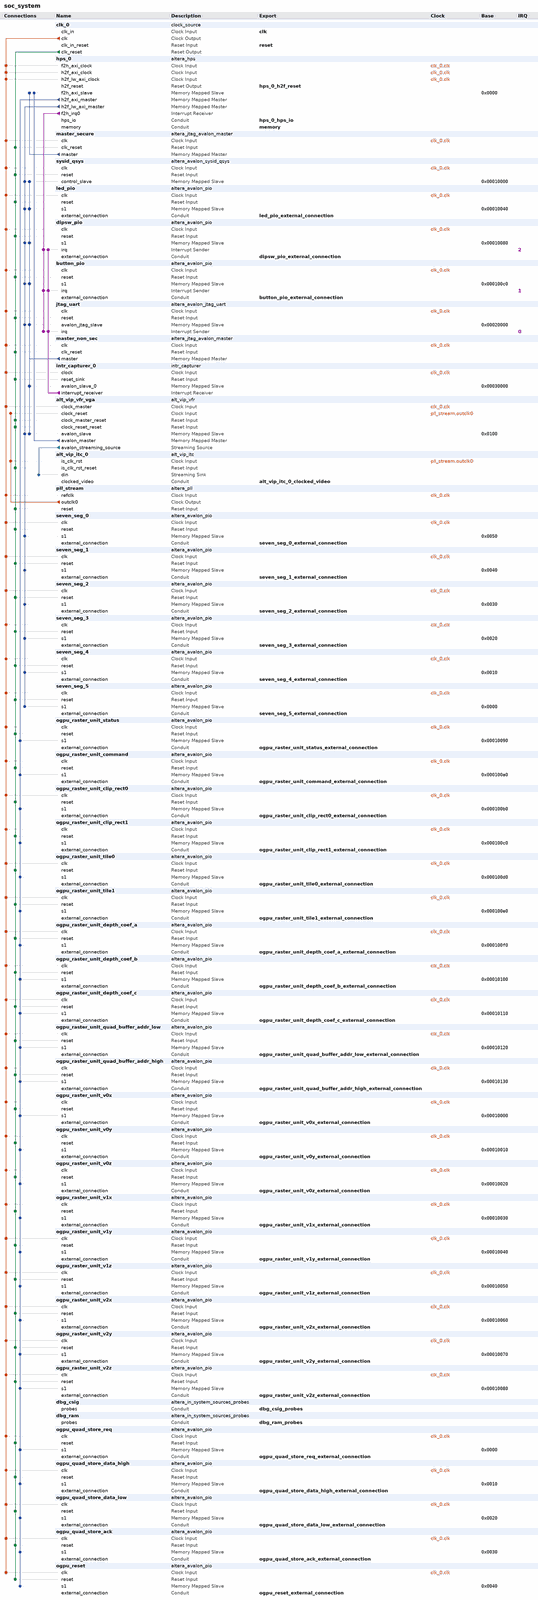
[diagram p0: system contents, whole]
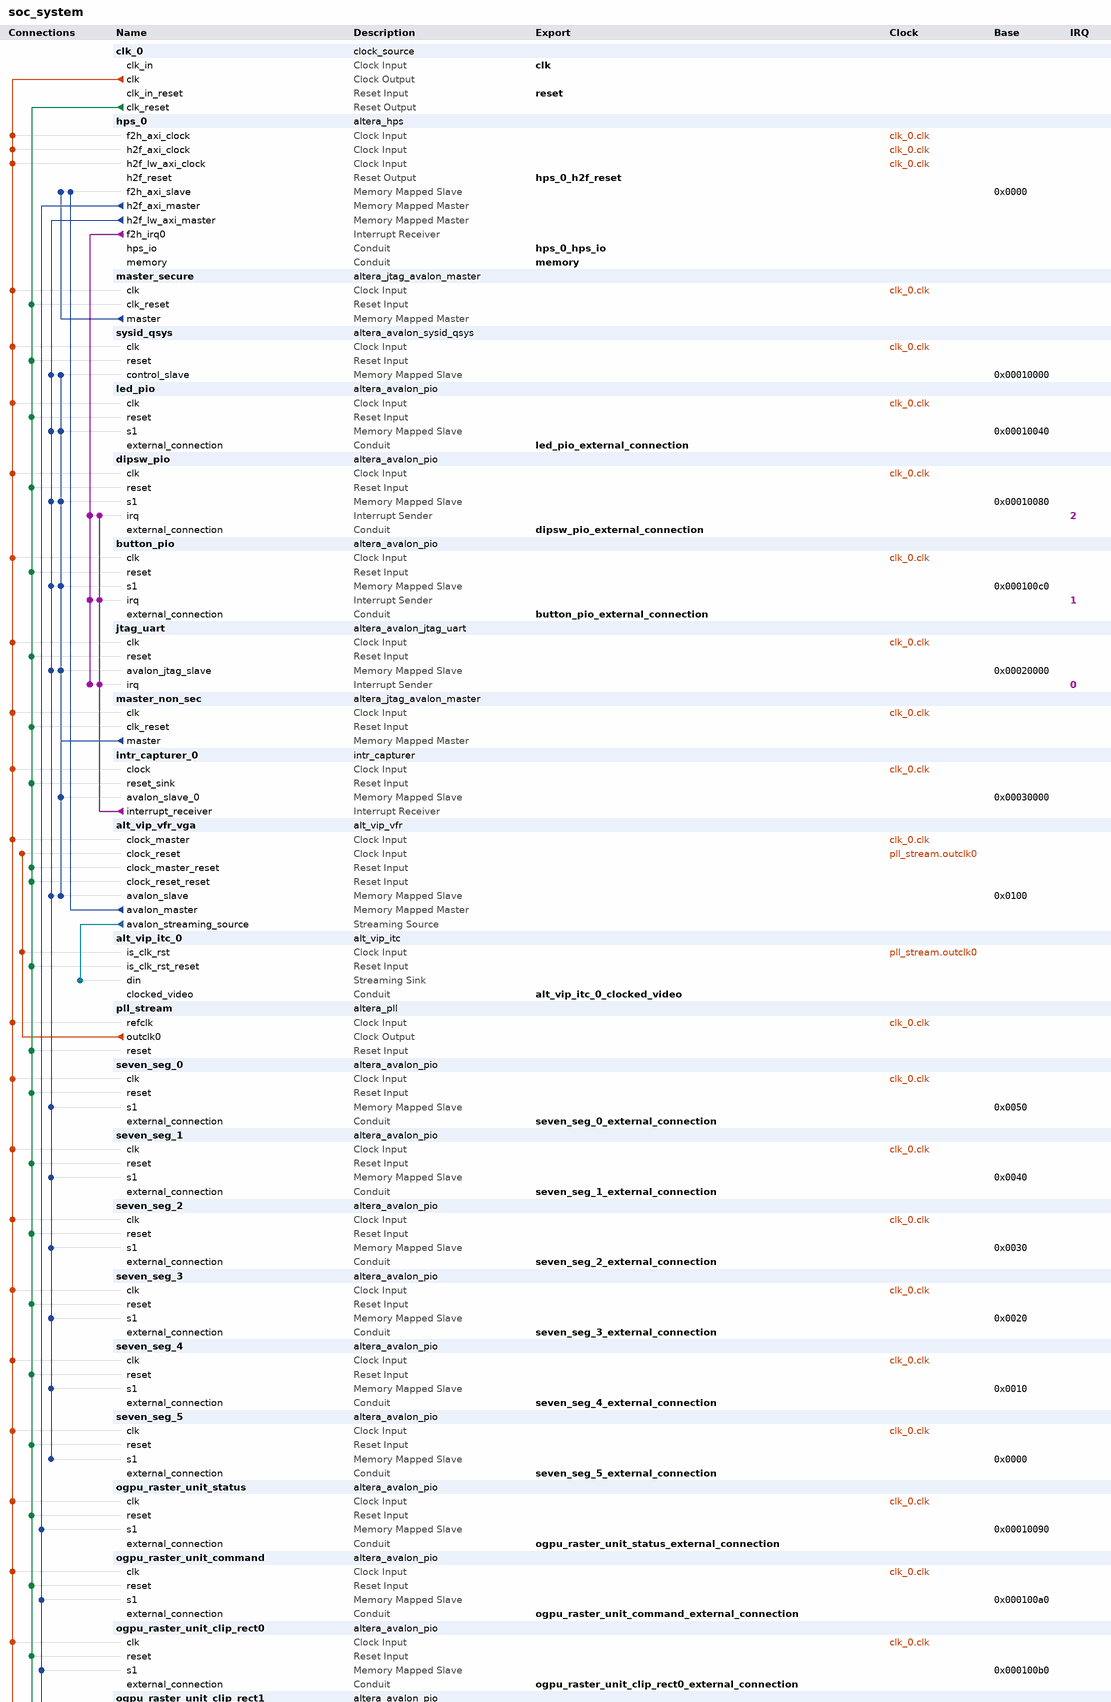
[diagram p1: system contents, upper part]
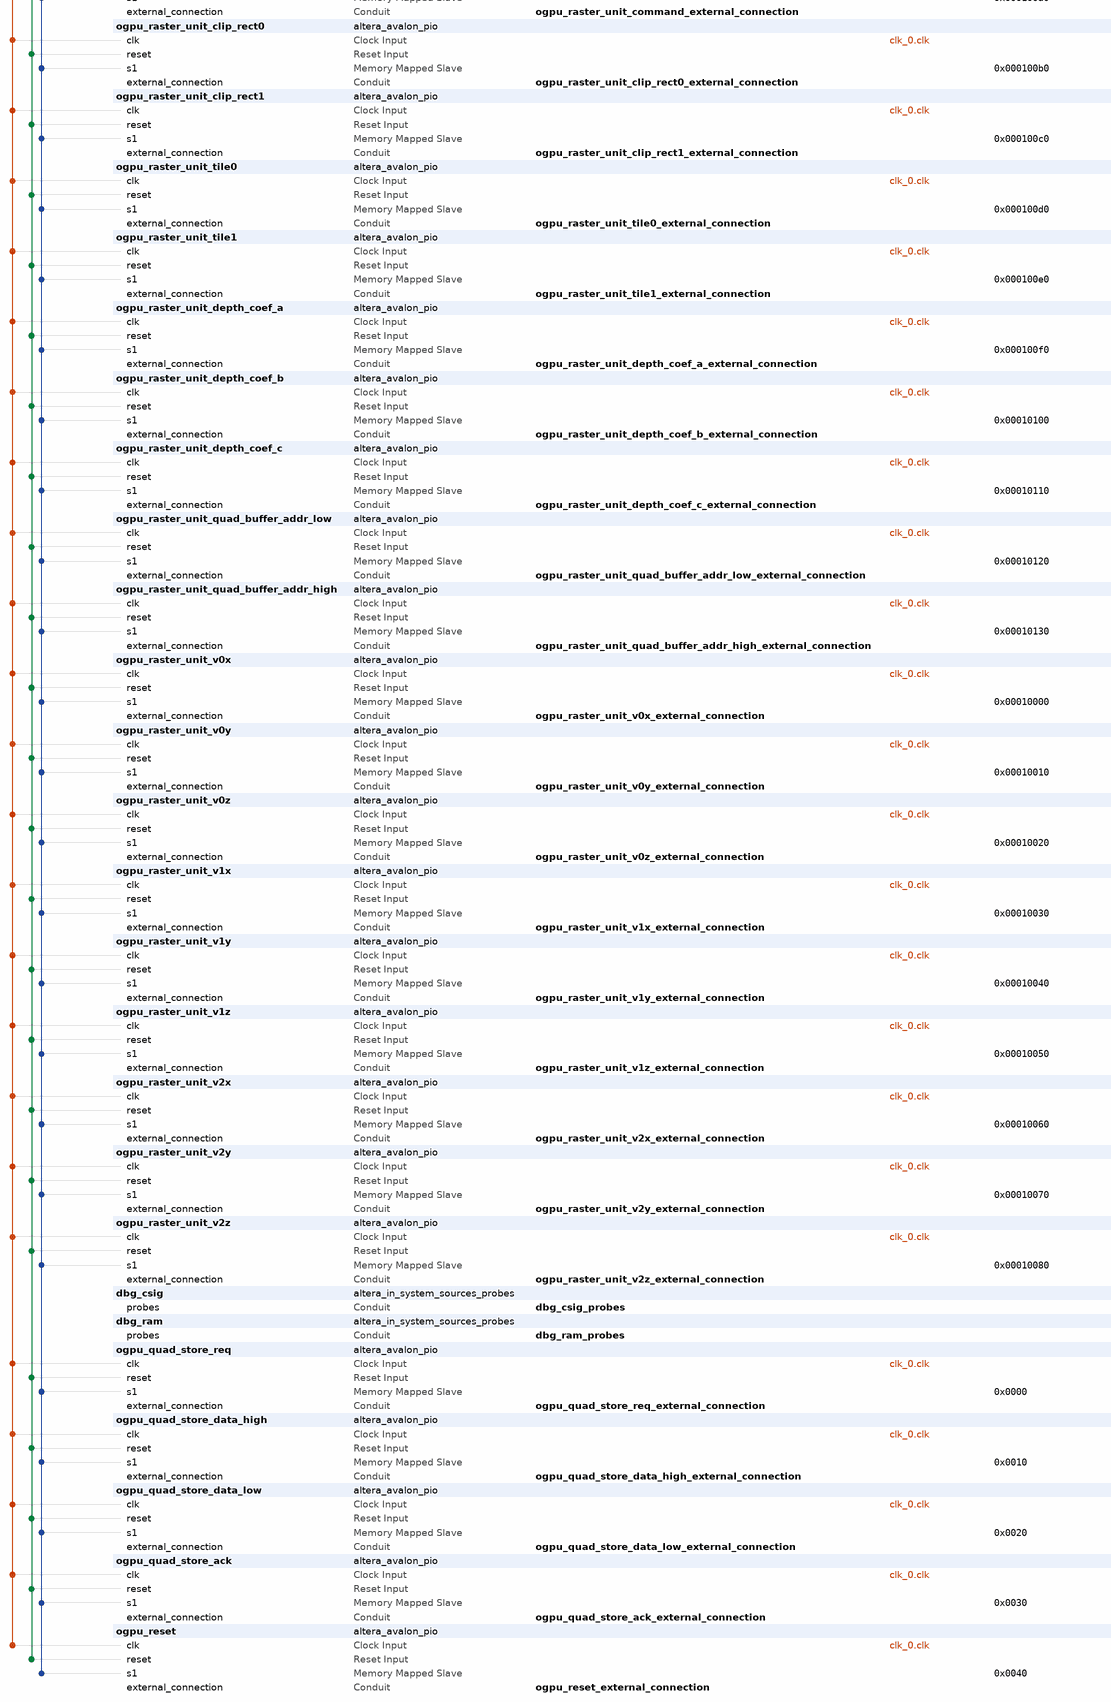
[diagram p2: system contents, lower part]
# Platform Designer (Qsys) system soc_system, Cyclone V 5CSEMA5F31C6
# Parameters at their usual value, and those the tool derives, are not listed.
package require -exact qsys 16.0
create_system soc_system
set_project_property DEVICE_FAMILY {Cyclone V}
set_project_property DEVICE 5CSEMA5F31C6

add_instance clk_0 clock_source 16.0
set_instance_parameter_value clk_0 clockFrequency 50000000

add_instance hps_0 altera_hps 16.0
set_instance_parameter_value hps_0 BOOTFROMFPGA_Enable true
set_instance_parameter_value hps_0 EMAC1_Mode RGMII
set_instance_parameter_value hps_0 EMAC1_PinMuxing {HPS I/O Set 0}
set_instance_parameter_value hps_0 F2SCLK_COLDRST_Enable false
set_instance_parameter_value hps_0 F2SCLK_DBGRST_Enable false
set_instance_parameter_value hps_0 F2SCLK_WARMRST_Enable false
set_instance_parameter_value hps_0 F2SINTERRUPT_Enable true
set_instance_parameter_value hps_0 F2S_Width 3
set_instance_parameter_value hps_0 FPGA_PERIPHERAL_OUTPUT_CLOCK_FREQ_EMAC0_GTX_CLK 100
set_instance_parameter_value hps_0 FPGA_PERIPHERAL_OUTPUT_CLOCK_FREQ_EMAC0_MD_CLK 100.0
set_instance_parameter_value hps_0 FPGA_PERIPHERAL_OUTPUT_CLOCK_FREQ_EMAC1_GTX_CLK 100
set_instance_parameter_value hps_0 FPGA_PERIPHERAL_OUTPUT_CLOCK_FREQ_EMAC1_MD_CLK 100.0
set_instance_parameter_value hps_0 HPS_PROTOCOL DDR3
set_instance_parameter_value hps_0 I2C0_Mode I2C
set_instance_parameter_value hps_0 I2C0_PinMuxing {HPS I/O Set 0}
set_instance_parameter_value hps_0 I2C1_Mode I2C
set_instance_parameter_value hps_0 I2C1_PinMuxing {HPS I/O Set 0}
set_instance_parameter_value hps_0 LWH2F_Enable true
set_instance_parameter_value hps_0 MEM_BANKADDR_WIDTH 3
set_instance_parameter_value hps_0 MEM_CLK_FREQ 400.0
set_instance_parameter_value hps_0 MEM_COL_ADDR_WIDTH 10
set_instance_parameter_value hps_0 MEM_DQ_WIDTH 32
set_instance_parameter_value hps_0 MEM_DRV_STR RZQ/7
set_instance_parameter_value hps_0 MEM_ROW_ADDR_WIDTH 15
set_instance_parameter_value hps_0 MEM_RTT_NOM RZQ/4
set_instance_parameter_value hps_0 MEM_RTT_WR RZQ/4
set_instance_parameter_value hps_0 MEM_TCL 11
set_instance_parameter_value hps_0 MEM_TFAW_NS 30.0
set_instance_parameter_value hps_0 MEM_TRAS_NS 35.0
set_instance_parameter_value hps_0 MEM_TRCD_NS 13.75
set_instance_parameter_value hps_0 MEM_TRFC_NS 260.0
set_instance_parameter_value hps_0 MEM_TRP_NS 13.75
set_instance_parameter_value hps_0 MEM_VENDOR JEDEC
set_instance_parameter_value hps_0 MEM_WTCL 8
set_instance_parameter_value hps_0 QSPI_Mode {1 SS}
set_instance_parameter_value hps_0 QSPI_PinMuxing {HPS I/O Set 0}
set_instance_parameter_value hps_0 REF_CLK_FREQ 25.0
set_instance_parameter_value hps_0 S2FCLK_USER2CLK 1
set_instance_parameter_value hps_0 S2F_Width 2
set_instance_parameter_value hps_0 SDIO_Mode {4-bit Data}
set_instance_parameter_value hps_0 SDIO_PinMuxing {HPS I/O Set 0}
set_instance_parameter_value hps_0 SPIM1_Mode {Single Slave Select}
set_instance_parameter_value hps_0 SPIM1_PinMuxing {HPS I/O Set 0}
set_instance_parameter_value hps_0 STM_Enable false
set_instance_parameter_value hps_0 TIMING_BOARD_AC_SKEW 0.03
set_instance_parameter_value hps_0 TIMING_BOARD_AC_TO_CK_SKEW 0.0
set_instance_parameter_value hps_0 TIMING_BOARD_DQ_TO_DQS_SKEW 0.0
set_instance_parameter_value hps_0 TIMING_BOARD_MAX_CK_DELAY 0.03
set_instance_parameter_value hps_0 TIMING_BOARD_MAX_DQS_DELAY 0.02
set_instance_parameter_value hps_0 TIMING_BOARD_SKEW_BETWEEN_DQS 0.08
set_instance_parameter_value hps_0 TIMING_BOARD_SKEW_CKDQS_DIMM_MAX 0.16
set_instance_parameter_value hps_0 TIMING_BOARD_SKEW_CKDQS_DIMM_MIN 0.09
set_instance_parameter_value hps_0 TIMING_BOARD_SKEW_WITHIN_DQS 0.01
set_instance_parameter_value hps_0 TIMING_TDH 65
set_instance_parameter_value hps_0 TIMING_TDQSCK 255
set_instance_parameter_value hps_0 TIMING_TDQSQ 125
set_instance_parameter_value hps_0 TIMING_TDS 30
set_instance_parameter_value hps_0 TIMING_TIH 140
set_instance_parameter_value hps_0 TIMING_TIS 180
set_instance_parameter_value hps_0 TIMING_TQSH 0.4
set_instance_parameter_value hps_0 UART0_Mode {No Flow Control}
set_instance_parameter_value hps_0 UART0_PinMuxing {HPS I/O Set 0}
set_instance_parameter_value hps_0 USB1_Mode SDR
set_instance_parameter_value hps_0 USB1_PinMuxing {HPS I/O Set 0}
set_instance_parameter_value hps_0 desired_cfg_clk_mhz 100.0
set_instance_parameter_value hps_0 desired_qspi_clk_mhz 400.0

add_instance master_secure altera_jtag_avalon_master 16.0

add_instance sysid_qsys altera_avalon_sysid_qsys 16.0
set_instance_parameter_value sysid_qsys id -1395322110

add_instance led_pio altera_avalon_pio 16.0
set_instance_parameter_value led_pio direction Output
set_instance_parameter_value led_pio width 10

add_instance dipsw_pio altera_avalon_pio 16.0
set_instance_parameter_value dipsw_pio bitClearingEdgeCapReg true
set_instance_parameter_value dipsw_pio captureEdge true
set_instance_parameter_value dipsw_pio direction Input
set_instance_parameter_value dipsw_pio edgeType ANY
set_instance_parameter_value dipsw_pio generateIRQ true
set_instance_parameter_value dipsw_pio irqType EDGE
set_instance_parameter_value dipsw_pio width 10

add_instance button_pio altera_avalon_pio 16.0
set_instance_parameter_value button_pio bitClearingEdgeCapReg true
set_instance_parameter_value button_pio captureEdge true
set_instance_parameter_value button_pio direction Input
set_instance_parameter_value button_pio edgeType FALLING
set_instance_parameter_value button_pio generateIRQ true
set_instance_parameter_value button_pio irqType EDGE
set_instance_parameter_value button_pio width 2

add_instance jtag_uart altera_avalon_jtag_uart 16.0
set_instance_parameter_value jtag_uart allowMultipleConnections true
set_instance_parameter_value jtag_uart simInteractiveOptions INTERACTIVE_ASCII_OUTPUT

add_instance master_non_sec altera_jtag_avalon_master 16.0

add_instance intr_capturer_0 intr_capturer 100.99.98.97

add_instance alt_vip_vfr_vga alt_vip_vfr 14.0
set_instance_parameter_value alt_vip_vfr_vga MAX_IMAGE_WIDTH 1024

add_instance alt_vip_itc_0 alt_vip_itc 14.0
set_instance_parameter_value alt_vip_itc_0 FIFO_DEPTH 1920
set_instance_parameter_value alt_vip_itc_0 H_ACTIVE_PIXELS 1024
set_instance_parameter_value alt_vip_itc_0 H_BACK_PORCH 160
set_instance_parameter_value alt_vip_itc_0 H_FRONT_PORCH 24
set_instance_parameter_value alt_vip_itc_0 H_SYNC_LENGTH 136
set_instance_parameter_value alt_vip_itc_0 NUMBER_OF_COLOUR_PLANES 4
set_instance_parameter_value alt_vip_itc_0 THRESHOLD 1919
set_instance_parameter_value alt_vip_itc_0 V_ACTIVE_LINES 768
set_instance_parameter_value alt_vip_itc_0 V_BACK_PORCH 29
set_instance_parameter_value alt_vip_itc_0 V_FRONT_PORCH 3
set_instance_parameter_value alt_vip_itc_0 V_SYNC_LENGTH 6

add_instance pll_stream altera_pll 16.0
set_instance_parameter_value pll_stream gui_device_speed_grade 2
set_instance_parameter_value pll_stream gui_number_of_clocks 1
set_instance_parameter_value pll_stream gui_operation_mode normal
set_instance_parameter_value pll_stream gui_output_clock_frequency0 130.0
set_instance_parameter_value pll_stream gui_pll_mode {Fractional-N PLL}
set_instance_parameter_value pll_stream gui_reference_clock_frequency 50.0
set_instance_parameter_value pll_stream gui_use_locked true

add_instance seven_seg_0 altera_avalon_pio 16.0
set_instance_parameter_value seven_seg_0 direction Output
set_instance_parameter_value seven_seg_0 width 7

add_instance seven_seg_1 altera_avalon_pio 16.0
set_instance_parameter_value seven_seg_1 direction Output
set_instance_parameter_value seven_seg_1 width 7

add_instance seven_seg_2 altera_avalon_pio 16.0
set_instance_parameter_value seven_seg_2 direction Output
set_instance_parameter_value seven_seg_2 width 7

add_instance seven_seg_3 altera_avalon_pio 16.0
set_instance_parameter_value seven_seg_3 direction Output
set_instance_parameter_value seven_seg_3 width 7

add_instance seven_seg_4 altera_avalon_pio 16.0
set_instance_parameter_value seven_seg_4 direction Output
set_instance_parameter_value seven_seg_4 width 7

add_instance seven_seg_5 altera_avalon_pio 16.0
set_instance_parameter_value seven_seg_5 direction Output
set_instance_parameter_value seven_seg_5 width 7

add_instance ogpu_raster_unit_status altera_avalon_pio 16.0
set_instance_parameter_value ogpu_raster_unit_status direction Input
set_instance_parameter_value ogpu_raster_unit_status width 32

add_instance ogpu_raster_unit_command altera_avalon_pio 16.0
set_instance_parameter_value ogpu_raster_unit_command direction Output
set_instance_parameter_value ogpu_raster_unit_command width 8

add_instance ogpu_raster_unit_clip_rect0 altera_avalon_pio 16.0
set_instance_parameter_value ogpu_raster_unit_clip_rect0 direction Output
set_instance_parameter_value ogpu_raster_unit_clip_rect0 width 32

add_instance ogpu_raster_unit_clip_rect1 altera_avalon_pio 16.0
set_instance_parameter_value ogpu_raster_unit_clip_rect1 direction Output
set_instance_parameter_value ogpu_raster_unit_clip_rect1 width 32

add_instance ogpu_raster_unit_tile0 altera_avalon_pio 16.0
set_instance_parameter_value ogpu_raster_unit_tile0 direction Output
set_instance_parameter_value ogpu_raster_unit_tile0 width 32

add_instance ogpu_raster_unit_tile1 altera_avalon_pio 16.0
set_instance_parameter_value ogpu_raster_unit_tile1 direction Output
set_instance_parameter_value ogpu_raster_unit_tile1 width 32

add_instance ogpu_raster_unit_depth_coef_a altera_avalon_pio 16.0
set_instance_parameter_value ogpu_raster_unit_depth_coef_a direction Output
set_instance_parameter_value ogpu_raster_unit_depth_coef_a width 32

add_instance ogpu_raster_unit_depth_coef_b altera_avalon_pio 16.0
set_instance_parameter_value ogpu_raster_unit_depth_coef_b direction Output
set_instance_parameter_value ogpu_raster_unit_depth_coef_b width 32

add_instance ogpu_raster_unit_depth_coef_c altera_avalon_pio 16.0
set_instance_parameter_value ogpu_raster_unit_depth_coef_c direction Output
set_instance_parameter_value ogpu_raster_unit_depth_coef_c width 32

add_instance ogpu_raster_unit_quad_buffer_addr_low altera_avalon_pio 16.0
set_instance_parameter_value ogpu_raster_unit_quad_buffer_addr_low direction Output
set_instance_parameter_value ogpu_raster_unit_quad_buffer_addr_low width 32

add_instance ogpu_raster_unit_quad_buffer_addr_high altera_avalon_pio 16.0
set_instance_parameter_value ogpu_raster_unit_quad_buffer_addr_high direction Output
set_instance_parameter_value ogpu_raster_unit_quad_buffer_addr_high width 32

add_instance ogpu_raster_unit_v0x altera_avalon_pio 16.0
set_instance_parameter_value ogpu_raster_unit_v0x direction Output
set_instance_parameter_value ogpu_raster_unit_v0x width 16

add_instance ogpu_raster_unit_v0y altera_avalon_pio 16.0
set_instance_parameter_value ogpu_raster_unit_v0y direction Output
set_instance_parameter_value ogpu_raster_unit_v0y width 16

add_instance ogpu_raster_unit_v0z altera_avalon_pio 16.0
set_instance_parameter_value ogpu_raster_unit_v0z direction Output
set_instance_parameter_value ogpu_raster_unit_v0z width 16

add_instance ogpu_raster_unit_v1x altera_avalon_pio 16.0
set_instance_parameter_value ogpu_raster_unit_v1x direction Output
set_instance_parameter_value ogpu_raster_unit_v1x width 16

add_instance ogpu_raster_unit_v1y altera_avalon_pio 16.0
set_instance_parameter_value ogpu_raster_unit_v1y direction Output
set_instance_parameter_value ogpu_raster_unit_v1y width 16

add_instance ogpu_raster_unit_v1z altera_avalon_pio 16.0
set_instance_parameter_value ogpu_raster_unit_v1z direction Output
set_instance_parameter_value ogpu_raster_unit_v1z width 16

add_instance ogpu_raster_unit_v2x altera_avalon_pio 16.0
set_instance_parameter_value ogpu_raster_unit_v2x direction Output
set_instance_parameter_value ogpu_raster_unit_v2x width 16

add_instance ogpu_raster_unit_v2y altera_avalon_pio 16.0
set_instance_parameter_value ogpu_raster_unit_v2y direction Output
set_instance_parameter_value ogpu_raster_unit_v2y width 16

add_instance ogpu_raster_unit_v2z altera_avalon_pio 16.0
set_instance_parameter_value ogpu_raster_unit_v2z direction Output
set_instance_parameter_value ogpu_raster_unit_v2z width 16

add_instance dbg_csig altera_in_system_sources_probes 16.0
set_instance_parameter_value dbg_csig create_source_clock false
set_instance_parameter_value dbg_csig instance_id CSIG
set_instance_parameter_value dbg_csig probe_width 12
set_instance_parameter_value dbg_csig source_width 0

add_instance dbg_ram altera_in_system_sources_probes 16.0
set_instance_parameter_value dbg_ram create_source_clock false
set_instance_parameter_value dbg_ram instance_id RAM0
set_instance_parameter_value dbg_ram probe_width 91
set_instance_parameter_value dbg_ram source_width 0

add_instance ogpu_quad_store_req altera_avalon_pio 16.0
set_instance_parameter_value ogpu_quad_store_req direction Input
set_instance_parameter_value ogpu_quad_store_req width 1

add_instance ogpu_quad_store_data_high altera_avalon_pio 16.0
set_instance_parameter_value ogpu_quad_store_data_high direction Input
set_instance_parameter_value ogpu_quad_store_data_high width 32

add_instance ogpu_quad_store_data_low altera_avalon_pio 16.0
set_instance_parameter_value ogpu_quad_store_data_low direction Input
set_instance_parameter_value ogpu_quad_store_data_low width 32

add_instance ogpu_quad_store_ack altera_avalon_pio 16.0
set_instance_parameter_value ogpu_quad_store_ack direction Output
set_instance_parameter_value ogpu_quad_store_ack width 1

add_instance ogpu_reset altera_avalon_pio 16.0
set_instance_parameter_value ogpu_reset direction Output
set_instance_parameter_value ogpu_reset width 1

# connections
add_connection clk_0.clk alt_vip_vfr_vga.clock_master clock
add_connection clk_0.clk button_pio.clk clock
add_connection clk_0.clk dipsw_pio.clk clock
add_connection clk_0.clk hps_0.f2h_axi_clock clock
add_connection clk_0.clk hps_0.h2f_axi_clock clock
add_connection clk_0.clk hps_0.h2f_lw_axi_clock clock
add_connection clk_0.clk intr_capturer_0.clock clock
add_connection clk_0.clk jtag_uart.clk clock
add_connection clk_0.clk led_pio.clk clock
add_connection clk_0.clk master_non_sec.clk clock
add_connection clk_0.clk master_secure.clk clock
add_connection clk_0.clk ogpu_quad_store_ack.clk clock
add_connection clk_0.clk ogpu_quad_store_data_high.clk clock
add_connection clk_0.clk ogpu_quad_store_data_low.clk clock
add_connection clk_0.clk ogpu_quad_store_req.clk clock
add_connection clk_0.clk ogpu_raster_unit_clip_rect0.clk clock
add_connection clk_0.clk ogpu_raster_unit_clip_rect1.clk clock
add_connection clk_0.clk ogpu_raster_unit_command.clk clock
add_connection clk_0.clk ogpu_raster_unit_depth_coef_a.clk clock
add_connection clk_0.clk ogpu_raster_unit_depth_coef_b.clk clock
add_connection clk_0.clk ogpu_raster_unit_depth_coef_c.clk clock
add_connection clk_0.clk ogpu_raster_unit_quad_buffer_addr_high.clk clock
add_connection clk_0.clk ogpu_raster_unit_quad_buffer_addr_low.clk clock
add_connection clk_0.clk ogpu_raster_unit_status.clk clock
add_connection clk_0.clk ogpu_raster_unit_tile0.clk clock
add_connection clk_0.clk ogpu_raster_unit_tile1.clk clock
add_connection clk_0.clk ogpu_raster_unit_v0x.clk clock
add_connection clk_0.clk ogpu_raster_unit_v0y.clk clock
add_connection clk_0.clk ogpu_raster_unit_v0z.clk clock
add_connection clk_0.clk ogpu_raster_unit_v1x.clk clock
add_connection clk_0.clk ogpu_raster_unit_v1y.clk clock
add_connection clk_0.clk ogpu_raster_unit_v1z.clk clock
add_connection clk_0.clk ogpu_raster_unit_v2x.clk clock
add_connection clk_0.clk ogpu_raster_unit_v2y.clk clock
add_connection clk_0.clk ogpu_raster_unit_v2z.clk clock
add_connection clk_0.clk ogpu_reset.clk clock
add_connection clk_0.clk pll_stream.refclk clock
add_connection clk_0.clk seven_seg_0.clk clock
add_connection clk_0.clk seven_seg_1.clk clock
add_connection clk_0.clk seven_seg_2.clk clock
add_connection clk_0.clk seven_seg_3.clk clock
add_connection clk_0.clk seven_seg_4.clk clock
add_connection clk_0.clk seven_seg_5.clk clock
add_connection clk_0.clk sysid_qsys.clk clock
add_connection pll_stream.outclk0 alt_vip_itc_0.is_clk_rst clock
add_connection pll_stream.outclk0 alt_vip_vfr_vga.clock_reset clock
add_connection clk_0.clk_reset alt_vip_itc_0.is_clk_rst_reset reset
add_connection clk_0.clk_reset alt_vip_vfr_vga.clock_master_reset reset
add_connection clk_0.clk_reset alt_vip_vfr_vga.clock_reset_reset reset
add_connection clk_0.clk_reset button_pio.reset reset
add_connection clk_0.clk_reset dipsw_pio.reset reset
add_connection clk_0.clk_reset intr_capturer_0.reset_sink reset
add_connection clk_0.clk_reset jtag_uart.reset reset
add_connection clk_0.clk_reset led_pio.reset reset
add_connection clk_0.clk_reset master_non_sec.clk_reset reset
add_connection clk_0.clk_reset master_secure.clk_reset reset
add_connection clk_0.clk_reset ogpu_quad_store_ack.reset reset
add_connection clk_0.clk_reset ogpu_quad_store_data_high.reset reset
add_connection clk_0.clk_reset ogpu_quad_store_data_low.reset reset
add_connection clk_0.clk_reset ogpu_quad_store_req.reset reset
add_connection clk_0.clk_reset ogpu_raster_unit_clip_rect0.reset reset
add_connection clk_0.clk_reset ogpu_raster_unit_clip_rect1.reset reset
add_connection clk_0.clk_reset ogpu_raster_unit_command.reset reset
add_connection clk_0.clk_reset ogpu_raster_unit_depth_coef_a.reset reset
add_connection clk_0.clk_reset ogpu_raster_unit_depth_coef_b.reset reset
add_connection clk_0.clk_reset ogpu_raster_unit_depth_coef_c.reset reset
add_connection clk_0.clk_reset ogpu_raster_unit_quad_buffer_addr_high.reset reset
add_connection clk_0.clk_reset ogpu_raster_unit_quad_buffer_addr_low.reset reset
add_connection clk_0.clk_reset ogpu_raster_unit_status.reset reset
add_connection clk_0.clk_reset ogpu_raster_unit_tile0.reset reset
add_connection clk_0.clk_reset ogpu_raster_unit_tile1.reset reset
add_connection clk_0.clk_reset ogpu_raster_unit_v0x.reset reset
add_connection clk_0.clk_reset ogpu_raster_unit_v0y.reset reset
add_connection clk_0.clk_reset ogpu_raster_unit_v0z.reset reset
add_connection clk_0.clk_reset ogpu_raster_unit_v1x.reset reset
add_connection clk_0.clk_reset ogpu_raster_unit_v1y.reset reset
add_connection clk_0.clk_reset ogpu_raster_unit_v1z.reset reset
add_connection clk_0.clk_reset ogpu_raster_unit_v2x.reset reset
add_connection clk_0.clk_reset ogpu_raster_unit_v2y.reset reset
add_connection clk_0.clk_reset ogpu_raster_unit_v2z.reset reset
add_connection clk_0.clk_reset ogpu_reset.reset reset
add_connection clk_0.clk_reset pll_stream.reset reset
add_connection clk_0.clk_reset seven_seg_0.reset reset
add_connection clk_0.clk_reset seven_seg_1.reset reset
add_connection clk_0.clk_reset seven_seg_2.reset reset
add_connection clk_0.clk_reset seven_seg_3.reset reset
add_connection clk_0.clk_reset seven_seg_4.reset reset
add_connection clk_0.clk_reset seven_seg_5.reset reset
add_connection clk_0.clk_reset sysid_qsys.reset reset
add_connection alt_vip_vfr_vga.avalon_master hps_0.f2h_axi_slave avalon
set_connection_parameter_value alt_vip_vfr_vga.avalon_master/hps_0.f2h_axi_slave baseAddress 0x0000
add_connection hps_0.h2f_axi_master ogpu_quad_store_ack.s1 avalon
set_connection_parameter_value hps_0.h2f_axi_master/ogpu_quad_store_ack.s1 baseAddress 0x0030
add_connection hps_0.h2f_axi_master ogpu_quad_store_data_high.s1 avalon
set_connection_parameter_value hps_0.h2f_axi_master/ogpu_quad_store_data_high.s1 baseAddress 0x0010
add_connection hps_0.h2f_axi_master ogpu_quad_store_data_low.s1 avalon
set_connection_parameter_value hps_0.h2f_axi_master/ogpu_quad_store_data_low.s1 baseAddress 0x0020
add_connection hps_0.h2f_axi_master ogpu_quad_store_req.s1 avalon
set_connection_parameter_value hps_0.h2f_axi_master/ogpu_quad_store_req.s1 baseAddress 0x0000
add_connection hps_0.h2f_axi_master ogpu_raster_unit_clip_rect0.s1 avalon
set_connection_parameter_value hps_0.h2f_axi_master/ogpu_raster_unit_clip_rect0.s1 baseAddress 0x000100b0
add_connection hps_0.h2f_axi_master ogpu_raster_unit_clip_rect1.s1 avalon
set_connection_parameter_value hps_0.h2f_axi_master/ogpu_raster_unit_clip_rect1.s1 baseAddress 0x000100c0
add_connection hps_0.h2f_axi_master ogpu_raster_unit_command.s1 avalon
set_connection_parameter_value hps_0.h2f_axi_master/ogpu_raster_unit_command.s1 baseAddress 0x000100a0
add_connection hps_0.h2f_axi_master ogpu_raster_unit_depth_coef_a.s1 avalon
set_connection_parameter_value hps_0.h2f_axi_master/ogpu_raster_unit_depth_coef_a.s1 baseAddress 0x000100f0
add_connection hps_0.h2f_axi_master ogpu_raster_unit_depth_coef_b.s1 avalon
set_connection_parameter_value hps_0.h2f_axi_master/ogpu_raster_unit_depth_coef_b.s1 baseAddress 0x00010100
add_connection hps_0.h2f_axi_master ogpu_raster_unit_depth_coef_c.s1 avalon
set_connection_parameter_value hps_0.h2f_axi_master/ogpu_raster_unit_depth_coef_c.s1 baseAddress 0x00010110
add_connection hps_0.h2f_axi_master ogpu_raster_unit_quad_buffer_addr_high.s1 avalon
set_connection_parameter_value hps_0.h2f_axi_master/ogpu_raster_unit_quad_buffer_addr_high.s1 baseAddress 0x00010130
add_connection hps_0.h2f_axi_master ogpu_raster_unit_quad_buffer_addr_low.s1 avalon
set_connection_parameter_value hps_0.h2f_axi_master/ogpu_raster_unit_quad_buffer_addr_low.s1 baseAddress 0x00010120
add_connection hps_0.h2f_axi_master ogpu_raster_unit_status.s1 avalon
set_connection_parameter_value hps_0.h2f_axi_master/ogpu_raster_unit_status.s1 baseAddress 0x00010090
add_connection hps_0.h2f_axi_master ogpu_raster_unit_tile0.s1 avalon
set_connection_parameter_value hps_0.h2f_axi_master/ogpu_raster_unit_tile0.s1 baseAddress 0x000100d0
add_connection hps_0.h2f_axi_master ogpu_raster_unit_tile1.s1 avalon
set_connection_parameter_value hps_0.h2f_axi_master/ogpu_raster_unit_tile1.s1 baseAddress 0x000100e0
add_connection hps_0.h2f_axi_master ogpu_raster_unit_v0x.s1 avalon
set_connection_parameter_value hps_0.h2f_axi_master/ogpu_raster_unit_v0x.s1 baseAddress 0x00010000
add_connection hps_0.h2f_axi_master ogpu_raster_unit_v0y.s1 avalon
set_connection_parameter_value hps_0.h2f_axi_master/ogpu_raster_unit_v0y.s1 baseAddress 0x00010010
add_connection hps_0.h2f_axi_master ogpu_raster_unit_v0z.s1 avalon
set_connection_parameter_value hps_0.h2f_axi_master/ogpu_raster_unit_v0z.s1 baseAddress 0x00010020
add_connection hps_0.h2f_axi_master ogpu_raster_unit_v1x.s1 avalon
set_connection_parameter_value hps_0.h2f_axi_master/ogpu_raster_unit_v1x.s1 baseAddress 0x00010030
add_connection hps_0.h2f_axi_master ogpu_raster_unit_v1y.s1 avalon
set_connection_parameter_value hps_0.h2f_axi_master/ogpu_raster_unit_v1y.s1 baseAddress 0x00010040
add_connection hps_0.h2f_axi_master ogpu_raster_unit_v1z.s1 avalon
set_connection_parameter_value hps_0.h2f_axi_master/ogpu_raster_unit_v1z.s1 baseAddress 0x00010050
add_connection hps_0.h2f_axi_master ogpu_raster_unit_v2x.s1 avalon
set_connection_parameter_value hps_0.h2f_axi_master/ogpu_raster_unit_v2x.s1 baseAddress 0x00010060
add_connection hps_0.h2f_axi_master ogpu_raster_unit_v2y.s1 avalon
set_connection_parameter_value hps_0.h2f_axi_master/ogpu_raster_unit_v2y.s1 baseAddress 0x00010070
add_connection hps_0.h2f_axi_master ogpu_raster_unit_v2z.s1 avalon
set_connection_parameter_value hps_0.h2f_axi_master/ogpu_raster_unit_v2z.s1 baseAddress 0x00010080
add_connection hps_0.h2f_axi_master ogpu_reset.s1 avalon
set_connection_parameter_value hps_0.h2f_axi_master/ogpu_reset.s1 baseAddress 0x0040
add_connection hps_0.h2f_lw_axi_master alt_vip_vfr_vga.avalon_slave avalon
set_connection_parameter_value hps_0.h2f_lw_axi_master/alt_vip_vfr_vga.avalon_slave baseAddress 0x0100
add_connection hps_0.h2f_lw_axi_master button_pio.s1 avalon
set_connection_parameter_value hps_0.h2f_lw_axi_master/button_pio.s1 baseAddress 0x000100c0
add_connection hps_0.h2f_lw_axi_master dipsw_pio.s1 avalon
set_connection_parameter_value hps_0.h2f_lw_axi_master/dipsw_pio.s1 baseAddress 0x00010080
add_connection hps_0.h2f_lw_axi_master jtag_uart.avalon_jtag_slave avalon
set_connection_parameter_value hps_0.h2f_lw_axi_master/jtag_uart.avalon_jtag_slave baseAddress 0x00020000
add_connection hps_0.h2f_lw_axi_master led_pio.s1 avalon
set_connection_parameter_value hps_0.h2f_lw_axi_master/led_pio.s1 baseAddress 0x00010040
add_connection hps_0.h2f_lw_axi_master seven_seg_0.s1 avalon
set_connection_parameter_value hps_0.h2f_lw_axi_master/seven_seg_0.s1 baseAddress 0x0050
add_connection hps_0.h2f_lw_axi_master seven_seg_1.s1 avalon
set_connection_parameter_value hps_0.h2f_lw_axi_master/seven_seg_1.s1 baseAddress 0x0040
add_connection hps_0.h2f_lw_axi_master seven_seg_2.s1 avalon
set_connection_parameter_value hps_0.h2f_lw_axi_master/seven_seg_2.s1 baseAddress 0x0030
add_connection hps_0.h2f_lw_axi_master seven_seg_3.s1 avalon
set_connection_parameter_value hps_0.h2f_lw_axi_master/seven_seg_3.s1 baseAddress 0x0020
add_connection hps_0.h2f_lw_axi_master seven_seg_4.s1 avalon
set_connection_parameter_value hps_0.h2f_lw_axi_master/seven_seg_4.s1 baseAddress 0x0010
add_connection hps_0.h2f_lw_axi_master seven_seg_5.s1 avalon
set_connection_parameter_value hps_0.h2f_lw_axi_master/seven_seg_5.s1 baseAddress 0x0000
add_connection hps_0.h2f_lw_axi_master sysid_qsys.control_slave avalon
set_connection_parameter_value hps_0.h2f_lw_axi_master/sysid_qsys.control_slave baseAddress 0x00010000
add_connection master_non_sec.master alt_vip_vfr_vga.avalon_slave avalon
set_connection_parameter_value master_non_sec.master/alt_vip_vfr_vga.avalon_slave baseAddress 0x0100
add_connection master_non_sec.master button_pio.s1 avalon
set_connection_parameter_value master_non_sec.master/button_pio.s1 baseAddress 0x000100c0
add_connection master_non_sec.master dipsw_pio.s1 avalon
set_connection_parameter_value master_non_sec.master/dipsw_pio.s1 baseAddress 0x00010080
add_connection master_non_sec.master intr_capturer_0.avalon_slave_0 avalon
set_connection_parameter_value master_non_sec.master/intr_capturer_0.avalon_slave_0 baseAddress 0x00030000
add_connection master_non_sec.master jtag_uart.avalon_jtag_slave avalon
set_connection_parameter_value master_non_sec.master/jtag_uart.avalon_jtag_slave baseAddress 0x00020000
add_connection master_non_sec.master led_pio.s1 avalon
set_connection_parameter_value master_non_sec.master/led_pio.s1 baseAddress 0x00010040
add_connection master_non_sec.master sysid_qsys.control_slave avalon
set_connection_parameter_value master_non_sec.master/sysid_qsys.control_slave baseAddress 0x00010000
add_connection master_secure.master hps_0.f2h_axi_slave avalon
set_connection_parameter_value master_secure.master/hps_0.f2h_axi_slave baseAddress 0x0000
add_connection alt_vip_vfr_vga.avalon_streaming_source alt_vip_itc_0.din avalon_streaming
add_connection hps_0.f2h_irq0 button_pio.irq interrupt
set_connection_parameter_value hps_0.f2h_irq0/button_pio.irq irqNumber 1
add_connection hps_0.f2h_irq0 dipsw_pio.irq interrupt
set_connection_parameter_value hps_0.f2h_irq0/dipsw_pio.irq irqNumber 2
add_connection hps_0.f2h_irq0 jtag_uart.irq interrupt
set_connection_parameter_value hps_0.f2h_irq0/jtag_uart.irq irqNumber 0
add_connection intr_capturer_0.interrupt_receiver button_pio.irq interrupt
set_connection_parameter_value intr_capturer_0.interrupt_receiver/button_pio.irq irqNumber 1
add_connection intr_capturer_0.interrupt_receiver dipsw_pio.irq interrupt
set_connection_parameter_value intr_capturer_0.interrupt_receiver/dipsw_pio.irq irqNumber 2
add_connection intr_capturer_0.interrupt_receiver jtag_uart.irq interrupt
set_connection_parameter_value intr_capturer_0.interrupt_receiver/jtag_uart.irq irqNumber 0

# exported interfaces
add_interface alt_vip_itc_0_clocked_video conduit end
set_interface_property alt_vip_itc_0_clocked_video EXPORT_OF alt_vip_itc_0.clocked_video
add_interface button_pio_external_connection conduit end
set_interface_property button_pio_external_connection EXPORT_OF button_pio.external_connection
add_interface clk clock sink
set_interface_property clk EXPORT_OF clk_0.clk_in
add_interface dbg_csig_probes conduit end
set_interface_property dbg_csig_probes EXPORT_OF dbg_csig.probes
add_interface dbg_ram_probes conduit end
set_interface_property dbg_ram_probes EXPORT_OF dbg_ram.probes
add_interface dipsw_pio_external_connection conduit end
set_interface_property dipsw_pio_external_connection EXPORT_OF dipsw_pio.external_connection
add_interface hps_0_h2f_reset reset source
set_interface_property hps_0_h2f_reset EXPORT_OF hps_0.h2f_reset
add_interface hps_0_hps_io conduit end
set_interface_property hps_0_hps_io EXPORT_OF hps_0.hps_io
add_interface led_pio_external_connection conduit end
set_interface_property led_pio_external_connection EXPORT_OF led_pio.external_connection
add_interface memory conduit end
set_interface_property memory EXPORT_OF hps_0.memory
add_interface ogpu_quad_store_ack_external_connection conduit end
set_interface_property ogpu_quad_store_ack_external_connection EXPORT_OF ogpu_quad_store_ack.external_connection
add_interface ogpu_quad_store_data_high_external_connection conduit end
set_interface_property ogpu_quad_store_data_high_external_connection EXPORT_OF ogpu_quad_store_data_high.external_connection
add_interface ogpu_quad_store_data_low_external_connection conduit end
set_interface_property ogpu_quad_store_data_low_external_connection EXPORT_OF ogpu_quad_store_data_low.external_connection
add_interface ogpu_quad_store_req_external_connection conduit end
set_interface_property ogpu_quad_store_req_external_connection EXPORT_OF ogpu_quad_store_req.external_connection
add_interface ogpu_raster_unit_clip_rect0_external_connection conduit end
set_interface_property ogpu_raster_unit_clip_rect0_external_connection EXPORT_OF ogpu_raster_unit_clip_rect0.external_connection
add_interface ogpu_raster_unit_clip_rect1_external_connection conduit end
set_interface_property ogpu_raster_unit_clip_rect1_external_connection EXPORT_OF ogpu_raster_unit_clip_rect1.external_connection
add_interface ogpu_raster_unit_command_external_connection conduit end
set_interface_property ogpu_raster_unit_command_external_connection EXPORT_OF ogpu_raster_unit_command.external_connection
add_interface ogpu_raster_unit_depth_coef_a_external_connection conduit end
set_interface_property ogpu_raster_unit_depth_coef_a_external_connection EXPORT_OF ogpu_raster_unit_depth_coef_a.external_connection
add_interface ogpu_raster_unit_depth_coef_b_external_connection conduit end
set_interface_property ogpu_raster_unit_depth_coef_b_external_connection EXPORT_OF ogpu_raster_unit_depth_coef_b.external_connection
add_interface ogpu_raster_unit_depth_coef_c_external_connection conduit end
set_interface_property ogpu_raster_unit_depth_coef_c_external_connection EXPORT_OF ogpu_raster_unit_depth_coef_c.external_connection
add_interface ogpu_raster_unit_quad_buffer_addr_high_external_connection conduit end
set_interface_property ogpu_raster_unit_quad_buffer_addr_high_external_connection EXPORT_OF ogpu_raster_unit_quad_buffer_addr_high.external_connection
add_interface ogpu_raster_unit_quad_buffer_addr_low_external_connection conduit end
set_interface_property ogpu_raster_unit_quad_buffer_addr_low_external_connection EXPORT_OF ogpu_raster_unit_quad_buffer_addr_low.external_connection
add_interface ogpu_raster_unit_status_external_connection conduit end
set_interface_property ogpu_raster_unit_status_external_connection EXPORT_OF ogpu_raster_unit_status.external_connection
add_interface ogpu_raster_unit_tile0_external_connection conduit end
set_interface_property ogpu_raster_unit_tile0_external_connection EXPORT_OF ogpu_raster_unit_tile0.external_connection
add_interface ogpu_raster_unit_tile1_external_connection conduit end
set_interface_property ogpu_raster_unit_tile1_external_connection EXPORT_OF ogpu_raster_unit_tile1.external_connection
add_interface ogpu_raster_unit_v0x_external_connection conduit end
set_interface_property ogpu_raster_unit_v0x_external_connection EXPORT_OF ogpu_raster_unit_v0x.external_connection
add_interface ogpu_raster_unit_v0y_external_connection conduit end
set_interface_property ogpu_raster_unit_v0y_external_connection EXPORT_OF ogpu_raster_unit_v0y.external_connection
add_interface ogpu_raster_unit_v0z_external_connection conduit end
set_interface_property ogpu_raster_unit_v0z_external_connection EXPORT_OF ogpu_raster_unit_v0z.external_connection
add_interface ogpu_raster_unit_v1x_external_connection conduit end
set_interface_property ogpu_raster_unit_v1x_external_connection EXPORT_OF ogpu_raster_unit_v1x.external_connection
add_interface ogpu_raster_unit_v1y_external_connection conduit end
set_interface_property ogpu_raster_unit_v1y_external_connection EXPORT_OF ogpu_raster_unit_v1y.external_connection
add_interface ogpu_raster_unit_v1z_external_connection conduit end
set_interface_property ogpu_raster_unit_v1z_external_connection EXPORT_OF ogpu_raster_unit_v1z.external_connection
add_interface ogpu_raster_unit_v2x_external_connection conduit end
set_interface_property ogpu_raster_unit_v2x_external_connection EXPORT_OF ogpu_raster_unit_v2x.external_connection
add_interface ogpu_raster_unit_v2y_external_connection conduit end
set_interface_property ogpu_raster_unit_v2y_external_connection EXPORT_OF ogpu_raster_unit_v2y.external_connection
add_interface ogpu_raster_unit_v2z_external_connection conduit end
set_interface_property ogpu_raster_unit_v2z_external_connection EXPORT_OF ogpu_raster_unit_v2z.external_connection
add_interface ogpu_reset_external_connection conduit end
set_interface_property ogpu_reset_external_connection EXPORT_OF ogpu_reset.external_connection
add_interface reset reset sink
set_interface_property reset EXPORT_OF clk_0.clk_in_reset
add_interface seven_seg_0_external_connection conduit end
set_interface_property seven_seg_0_external_connection EXPORT_OF seven_seg_0.external_connection
add_interface seven_seg_1_external_connection conduit end
set_interface_property seven_seg_1_external_connection EXPORT_OF seven_seg_1.external_connection
add_interface seven_seg_2_external_connection conduit end
set_interface_property seven_seg_2_external_connection EXPORT_OF seven_seg_2.external_connection
add_interface seven_seg_3_external_connection conduit end
set_interface_property seven_seg_3_external_connection EXPORT_OF seven_seg_3.external_connection
add_interface seven_seg_4_external_connection conduit end
set_interface_property seven_seg_4_external_connection EXPORT_OF seven_seg_4.external_connection
add_interface seven_seg_5_external_connection conduit end
set_interface_property seven_seg_5_external_connection EXPORT_OF seven_seg_5.external_connection

set_interconnect_requirement {$system} qsys_mm.clockCrossingAdapter HANDSHAKE
set_interconnect_requirement {$system} qsys_mm.maxAdditionalLatency 1

save_system soc_system.qsys
